# Altium project motordriver-v5.1.PrjPcb (part 2 of 3)

## Sheet motordriver-v5.0_driver-power-stage.SchDoc
size A4; SheetNumber: 6; SheetTotal: 12
Used 6 times, as channels Driver Power Stage 0, Driver Power Stage 1, Driver Power Stage 2, Driver Power Stage 3, Driver Power Stage 4, Driver Power Stage. Parts and nets are listed once, with the designators drawn on the sheet.
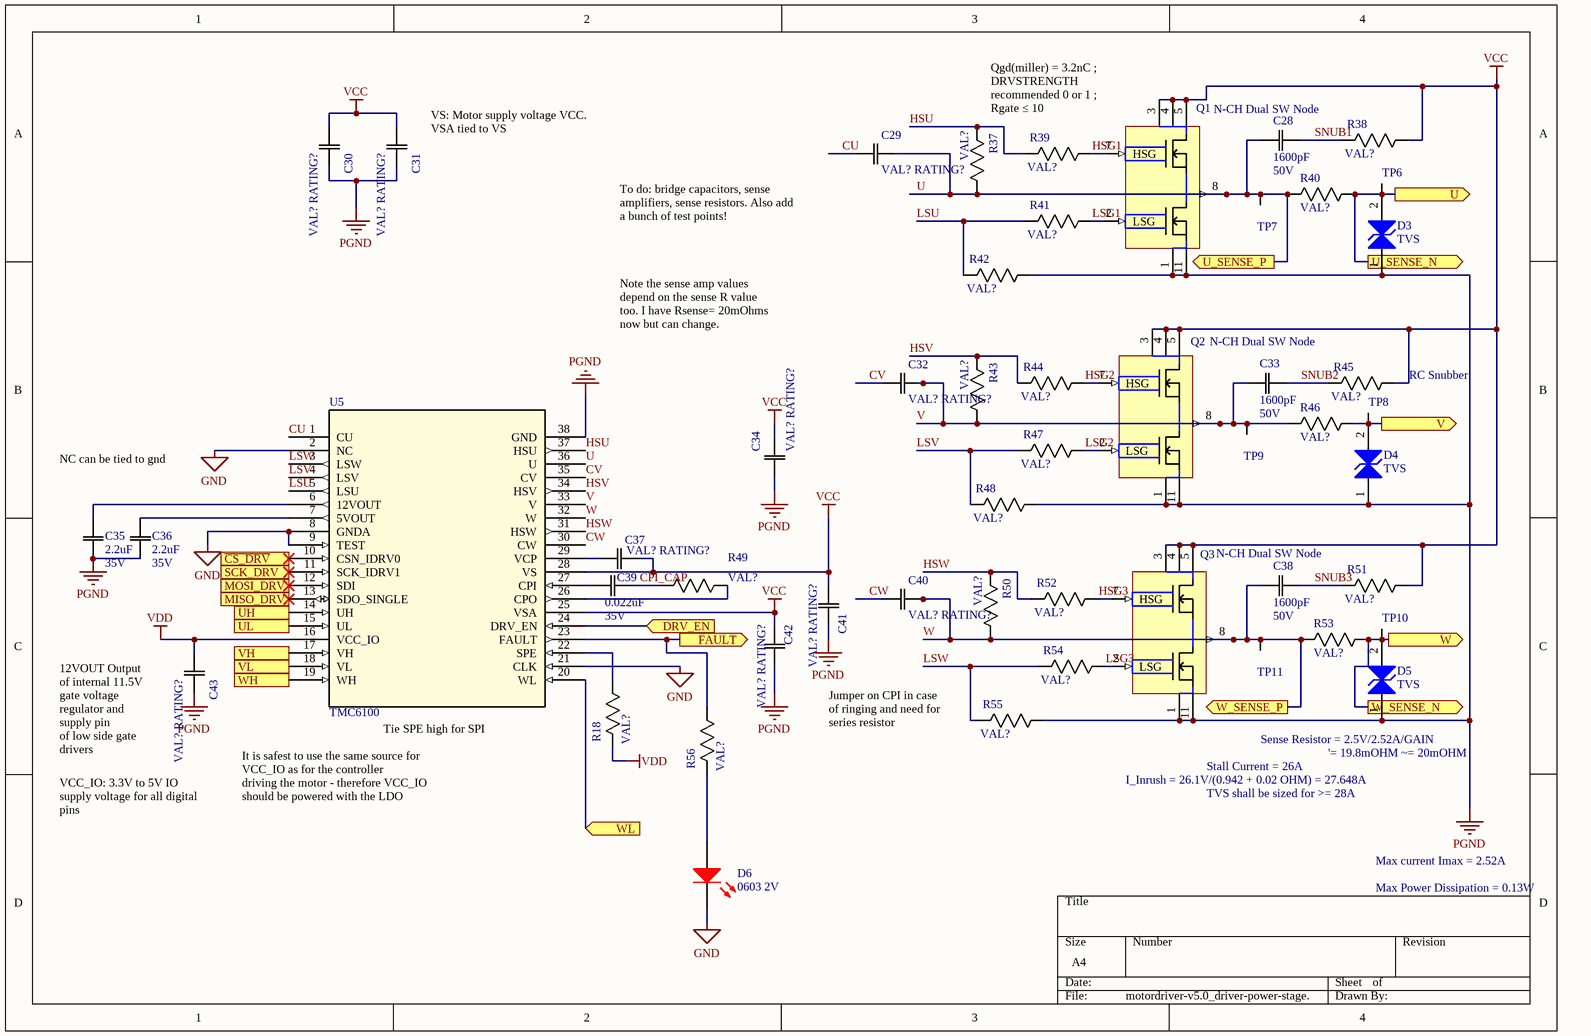
[diagram p6: motordriver-v5.0_driver-power-stage.SchDoc]

### Parts
C28  value 1600pF  Rating: 50V  [0603]  (hidden comment: VAL? RATING?)
C29  VAL? RATING?  [0603]
C30  VAL? RATING?  [0603]
C31  VAL? RATING?  [0805]
C32  VAL? RATING?  [0603]
C33  value 1600pF  Rating: 50V  [0603]  (hidden comment: VAL? RATING?)
C34  VAL? RATING?  [0805]
C35  value 2.2uF  Rating: 35V  [0603]  (hidden comment: VAL? RATING?)
C36  value 2.2uF  Rating: 35V  [0603]  (hidden comment: VAL? RATING?)
C37  VAL? RATING?  [0603]
C38  value 1600pF  Rating: 50V  [0603]  (hidden comment: VAL? RATING?)
C39  value 0.022uF  Rating: 35V  [0603]  (hidden comment: VAL? RATING?)
C40  VAL? RATING?  [0603]
C41  VAL? RATING?  [0603]
C42  VAL? RATING?  [0603]
C43  VAL? RATING?  [0603]
D3  TVS  [DO-214AC, SMA]
D4  TVS  [DO-214AC, SMA]
D5  TVS  [DO-214AC, SMA]
D6  0603 2V  [0603 - LED2]
Q1  N-CH Dual SW Node  [12-PowerWQFN]
Q2  N-CH Dual SW Node  [12-PowerWQFN]
Q3  N-CH Dual SW Node  [12-PowerWQFN]
R18  VAL?  [0603]
R37  VAL?  [0603]
R38  VAL?  [0603]
R39  VAL?  [0603]
R40  VAL?  [0603]
R41  VAL?  [0603]
R42  VAL?  [0603]
R43  VAL?  [0603]
R44  VAL?  [0603]
R45  VAL?  [0603]
R46  VAL?  [0603]
R47  VAL?  [0603]
R48  VAL?  [0603]
R49  VAL?  [0603]
R50  VAL?  [0603]
R51  VAL?  [0603]
R52  VAL?  [0603]
R53  VAL?  [0603]
R54  VAL?  [0603]
R55  VAL?  [0603]
R56  VAL?  [0603]
TP6  Test Point (Via)  [TP]  (value not drawn)
TP7  Test Point (Via)  [TP]  (value not drawn)
TP8  Test Point (Via)  [TP]  (value not drawn)
TP9  Test Point (Via)  [TP]  (value not drawn)
TP10  Test Point (Via)  [TP]  (value not drawn)
TP11  Test Point (Via)  [TP]  (value not drawn)
U5  TMC6100  [QFN50P700X700X85_HS-38N]

### Ports
DRV_EN (in), FAULT (out), MISO_DRV (out), MOSI_DRV (in), SCK_DRV (in), U (out), U_SENSE_N (out), U_SENSE_P (out), UH (in), UL (in), V (out), VH (in), VL (in), W (out), W_SENSE_N (out), W_SENSE_P (out), WH (in), WL (in), ~{CS_DRV} (in)

### Nets
GND: D6.2(K) U5.2(NC) U5.8(GNDA) U5.9(TEST) U5.21(CLK)
PGND: C30.2(C2) C31.2(C2) C34.1(C1) C35.1(C1) C36.1(C1) C41.2(C2) C42.2(C2) C43.2(C2) D3.1(K) D4.1(K) D5.1(K) Q1.1(GND) Q1.11(GND) Q2.1(GND) Q2.11(GND) Q3.1(GND) Q3.11(GND) R42.1(R1) R48.1(R1) R55.1(R1) U5.38(GND)
VCC: C30.1(C1) C31.1(C1) C34.2(C2) C37.2(C2) C41.1(C1) C42.1(C1) Q1.3(V+) Q1.4(V+) Q1.5(V+) Q2.3(V+) Q2.4(V+) Q2.5(V+) Q3.3(V+) Q3.4(V+) Q3.5(V+) R38.1(R1) R45.1(R1) R51.1(R1) U5.25(VSA) U5.28(VS)
VDD: C43.1(C1) R18.2(R2) U5.16(VCC_IO)
~{CS_DRV}: U5.10(CSN_IDRV0) ; port ~{CS_DRV}
CPI_CAP: C39.2(C2) R49.2(R2)
CU: C29.1(C1) U5.1(CU)
CV: C32.1(C1) U5.35(CV)
CW: C40.1(C1) U5.30(CW)
DRV_EN: U5.24(DRV_EN) ; port DRV_EN
FAULT: R56.1(R1) U5.23(FAULT) ; port FAULT
HSG1: Q1.7(HSG) R39.1(R1)
HSG2: Q2.7(HSG) R44.1(R1)
HSG3: Q3.7(HSG) R52.1(R1)
HSU: R37.2(R2) R39.2(R2) U5.37(HSU)
HSV: R43.2(R2) R44.2(R2) U5.34(HSV)
HSW: R50.2(R2) R52.2(R2) U5.31(HSW)
LSG1: Q1.2(LSG) R41.1(R1)
LSG2: Q2.2(LSG) R47.1(R1)
LSG3: Q3.2(LSG) R54.1(R1)
LSU: R41.2(R2) R42.2(R2) U5.5(LSU)
LSV: R47.2(R2) R48.2(R2) U5.4(LSV)
LSW: R54.2(R2) R55.2(R2) U5.3(LSW)
MISO_DRV: U5.13(SDO_SINGLE) ; port MISO_DRV
MOSI_DRV: U5.12(SDI) ; port MOSI_DRV
SCK_DRV: U5.11(SCK_IDRV1) ; port SCK_DRV
SNUB1: C28.1(C1) R38.2(R2)
SNUB2: C33.1(C1) R45.2(R2)
SNUB3: C38.1(C1) R51.2(R2)
U: C28.2(C2) C29.2(C2) Q1.8(SW) R37.1(R1) R40.2(R2) TP7.1 U5.36(U) ; port U_SENSE_P
U: D3.2(A) R40.1(R1) TP6.1 ; port U, port U_SENSE_N  [a separate net that carries the same name]
UH: U5.14(UH) ; port UH
UL: U5.15(UL) ; port UL
V: C32.2(C2) C33.2(C2) Q2.8(SW) R43.1(R1) R46.2(R2) TP9.1 U5.33(V)
V: D4.2(A) R46.1(R1) TP8.1 ; port V  [a separate net that carries the same name]
VH: U5.17(VH) ; port VH
VL: U5.18(VL) ; port VL
W: C38.2(C2) C40.2(C2) Q3.8(SW) R50.1(R1) R53.2(R2) TP11.1 U5.32(W) ; port W_SENSE_P
W: D5.2(A) R53.1(R1) TP10.1 ; port W, port W_SENSE_N  [a separate net that carries the same name]
WH: U5.19(WH) ; port WH
WL: U5.20(WL) ; port WL
NetC35_2: C35.2(C2) U5.6(12VOUT)
NetC36_2: C36.2(C2) U5.7(5VOUT)
NetC37_1: C37.1(C1) U5.29(VCP)
NetC39_1: C39.1(C1) U5.27(CPI)
NetD6_1: D6.1(A) R56.2(R2)
NetR18_1: R18.1(R1) U5.22(SPE)
NetR49_1: R49.1(R1) U5.26(CPO)

### Channels
Driver Power Stage 0: designators C28=C28A C29=C29A C30=C30A C31=C31A C32=C32A C33=C33A C34=C34A C35=C35A C36=C36A C37=C37A C38=C38A C39=C39A C40=C40A C41=C41A C42=C42A C43=C43A D3=D3A#2 D4=D4A#2 D5=D5A D6=D6A Q1=Q1A Q2=Q2A Q3=Q3A R18=R18A R37=R37A R38=R38A R39=R39A R40=R40A R41=R41A R42=R42A R43=R43A R44=R44A R45=R45A R46=R46A R47=R47A R48=R48A R49=R49A R50=R50A R51=R51A R52=R52A R53=R53A R54=R54A R55=R55A R56=R56A TP6=TP6A TP7=TP7A TP8=TP8A TP9=TP9A TP10=TP10A TP11=TP11A U5=U5A; ports DRV_EN=DRV_EN_0 FAULT=FAULT0 MISO_DRV=SPI_MISO_DRV0 MOSI_DRV=SPI_MOSI_DRV0 SCK_DRV=SPI_SCK_DRV0 U=U0 U_SENSE_N=U0 U_SENSE_P=U UH=UH0 UL=UL0 V=V0 VH=VH0 VL=VL0 W=W0 W_SENSE_N=W0 W_SENSE_P=W WH=WH0 WL=WL0 ~{CS_DRV}=~{CS_DRV}0
Driver Power Stage 1: designators C28=C28B C29=C29B C30=C30B C31=C31B C32=C32B C33=C33B C34=C34B C35=C35B C36=C36B C37=C37B C38=C38B C39=C39B C40=C40B C41=C41B C42=C42B C43=C43B D3=D3B#1 D4=D4B#1 D5=D5B D6=D6B Q1=Q1B Q2=Q2B Q3=Q3B R18=R18B R37=R37B R38=R38B R39=R39B R40=R40B R41=R41B R42=R42B R43=R43B R44=R44B R45=R45B R46=R46B R47=R47B R48=R48B R49=R49B R50=R50B R51=R51B R52=R52B R53=R53B R54=R54B R55=R55B R56=R56B TP6=TP6B TP7=TP7B TP8=TP8B TP9=TP9B TP10=TP10B TP11=TP11B U5=U5B; ports DRV_EN=DRV_EN_1 FAULT=FAULT1 MISO_DRV=SPI_MISO_DRV0 MOSI_DRV=SPI_MOSI_DRV0 SCK_DRV=SPI_SCK_DRV0 U=U1 U_SENSE_N=U1 U_SENSE_P=U UH=UH1 UL=UL1 V=V1 VH=VH1 VL=VL1 W=W1 W_SENSE_N=W1 W_SENSE_P=W WH=WH1 WL=WL1 ~{CS_DRV}=~{CS_DRV}1
Driver Power Stage 2: designators end in C; ports DRV_EN=DRV_EN_2 FAULT=FAULT2 MISO_DRV=SPI_MISO_DRV0 MOSI_DRV=SPI_MOSI_DRV0 SCK_DRV=SPI_SCK_DRV0 U=U2 U_SENSE_N=U2 U_SENSE_P=U UH=UH2 UL=UL2 V=V2 VH=VH2 VL=VL2 W=W2 W_SENSE_N=W2 W_SENSE_P=W WH=WH2 WL=WL2 ~{CS_DRV}=~{CS_DRV}2
Driver Power Stage 3: designators end in D; ports DRV_EN=DRV_EN_3 FAULT=FAULT3 MISO_DRV=SPI_MISO_DRV0 MOSI_DRV=SPI_MOSI_DRV0 SCK_DRV=SPI_SCK_DRV0 U=U3 U_SENSE_N=U3 U_SENSE_P=U UH=UH3 UL=UL3 V=V3 VH=VH3 VL=VL3 W=W3 W_SENSE_N=W3 W_SENSE_P=W WH=WH3 WL=WL3 ~{CS_DRV}=~{CS_DRV}3
Driver Power Stage 4: designators end in E; ports DRV_EN=DRV_EN_4 FAULT=FAULT4 MISO_DRV=SPI_MISO_DRV0 MOSI_DRV=SPI_MOSI_DRV0 SCK_DRV=SPI_SCK_DRV0 U=U4_IN U_SENSE_N=U4_IN U_SENSE_P=U UH=UH4 UL=UL4 V=V4_IN VH=VH4 VL=VL4 W=W4_IN W_SENSE_N=W4_IN W_SENSE_P=W WH=WH4 WL=WL4 ~{CS_DRV}=~{CS_DRV}4
Driver Power Stage: designators end in F; ports DRV_EN=DRV_EN FAULT=FAULT MISO_DRV=MISO_DRV_Driver Power Stage MOSI_DRV=MOSI_DRV_Driver Power Stage SCK_DRV=SCK_DRV_Driver Power Stage U=U_Driver Power Stage U_SENSE_N=U_Driver Power Stage U_SENSE_P=U_Driver Power Stage UH=UH_Driver Power Stage UL=UL_Driver Power Stage V=V_Driver Power Stage VH=VH_Driver Power Stage VL=VL_Driver Power Stage W=W_Driver Power Stage W_SENSE_N=W_Driver Power Stage W_SENSE_P=W_Driver Power Stage WH=WH_Driver Power Stage WL=WL_Driver Power Stage ~{CS_DRV}=~{CS_DRV}_Driver Power Stage

### Notes on the sheet
- Text
- (near Q1) Qgd(miller) = 3.2nC ; DRVSTRENGTH recommended 0 or 1 ; Rgate ≤ 10
- (near C31) VS: Motor supply voltage VCC. VSA tied to VS
- To do: bridge capacitors, sense amplifiers, sense resistors. Also add a bunch of test points!
- Note the sense amp values depend on the sense R value too. I have Rsense= 20mOhms now but can change.
- (near R45) RC Snubber
- NC can be tied to gnd
- (near C43) 12VOUT Output of internal 11.5V gate voltage regulator and supply pin
  of low side gate drivers
- Tie SPE high for SPI
- Jumper on CPI in case of ringing and need for series resistor
- I_Inrush = 26.1V/(0.942 + 0.02 OHM) = 27.648A
- Stall Current = 26A
- (near D5) Sense Resistor = 2.5V/2.52A/GAIN
- '= 19.8mOHM ~= 20mOHM
- VCC_IO: 3.3V to 5V IO supply voltage for all digital pins
- It is safest to use the same source for VCC_IO as for the controller
  driving the motor - therefore VCC_IO should be powered with the LDO
- TVS shall be sized for >= 28A
- Max current Imax = 2.52A
- Max Power Dissipation = 0.13W

### Library data of the parts
C28 C33 C38 = CAP 1600pF 50V: Default Symbol for Capacitors; Manufacturer Part Number 1: GRM1885C1H162JA01D; Tolerance: 5%; Temperature Coefficient: NP0; Part Number: CAP 1600pF 50V; Supplier 1: Digi-Key; Supplier Part Number 1: 490-1456-1-ND; Manufacturer Part Number 2: GRM2165C1H162JA01D; Supplier 2: Digi-Key; Supplier Part Number 2: 490-1625-1-ND
C29 C31 C32 C40 = CAP 470nF 50V: as C62 on sheet motordriver-v5.0_trinamic-controller-dribbler; Part Number: CAP 470nF 50V; Supplier 1: Digi-Key; Supplier Part Number 1: 445-5952-1-ND; Manufacturer Part Number 2: CL21B474KBFNNNG; Supplier 2: Digi-Key; Supplier Part Number 2: 1276-6482-1-ND
C30 C37 C41-C43 = CAP 100nF 50V: as C3 on sheet motordriver-v5.0_peripherals; Part Number: CAP 100nF 50V; Supplier 1: Digi-Key; Supplier Part Number 1: 311-3567-1-ND; Manufacturer Part Number 2: 0805J0500104KJT; Supplier 2: Digi-Key; Supplier Part Number 2: 1608-1458-1-ND
C34 = CAP 10uF 50V: Default Symbol for Capacitors; Manufacturer Part Number 1: GRM21BR61H106KE43L; Value: 10uF; Tolerance: 10%; Rating: 50V; Temperature Coefficient: X5R; Part Number: CAP 10uF 50V; Supplier 1: Digi-Key; Supplier Part Number 1: 490-18663-1-ND; Manufacturer Part Number 2: CL32B106KBJNNWE; Supplier 2: Digi-Key; Supplier Part Number 2: 1276-3388-1-ND
C35 C36 = CAP 2.2uF 35V: Default Symbol for Capacitors; Manufacturer Part Number 1: C1608X5R1V225K080AC; Tolerance: 10%; Temperature Coefficient: X5R; Part Number: CAP 2.2uF 35V; Supplier 1: Digi-Key; Supplier Part Number 1: 445-8025-1-ND; Manufacturer Part Number 2: CGA4J1X7R1V225K125AE; Supplier 2: Digi-Key; Supplier Part Number 2: 445-8787-1-ND
C39 = CAP 0.022uF 35V: Default Symbol for Capacitors; Manufacturer Part Number 1: GMK107BJ223KAHT; Tolerance: 10%; Temperature Coefficient: X7R; Part Number: CAP 0.022uF 35V; Supplier 1: Digi-Key; Supplier Part Number 1: 587-3359-1-ND; Manufacturer Part Number 2: GMK212SD223KG-T; Supplier 2: Digi-Key; Supplier Part Number 2: 587-1122-1-ND
D3-D5 = DIODE TVS 26VWM 53.5VC SMA: TVS DIODE 26V 53.5V SMA; Manufacturer Part Number: SMAJ26CA-TR; Power: 400W; Voltage Rating - DC: 26VWM, 53.5VC; Current Rating: 43A; Supplier 1: Digi-Key; Supplier Part Number 1: 497-12523-1-ND; Part Number: DIODE TVS 26VWM 53.5VC SMA; Supplier URL 1: https://www.digikey.ca/en/products/detail/stmicroelectronics/SMAJ26CA-TR/2214530?s=N4IgTCBcDaICwE4DsBaAjGArGAzOlAcgCIgC6AvkA; Pin Count: 2
D6 = LED RED SMD 0603: 0603 red led alingap 631nm-639nm water clear 18-180mcd 130d; Manufacturer Part Number: LTST-C190KRKT; Current Rating: 20mA; Supplier 1: Digi-Key; Supplier Part Number 1: 160-1436-1-ND; Part Number: LED RED SMD 0603; Supplier URL 1: https://www.digikey.ca/en/products/detail/lite-on-inc/LTST-C190KRKT/386817?s=N4IgTCBcDaIIwDYAMBaOAWAzAtKByAIiALoC%2BQA; Pin Count: 2; Voltage Rating - DC: 2V
Q1-Q3 = MOSFET N-CH DUAL NTTFD4D0N04HLTWG: MOSFET N+N COMMON PHASE SW 40V 60A; Manufacturer: ON Semiconductor; Supplier 1: Digi-Key; Manufacturer Part Number: NTTFD4D0N04HLTWG; RoHS: Yes; Category: MOSFETs; Stock 1: 3000; Pricing 1: 1=1.51000, 10=1.34800, 100=1.05120, 500=0.86840, 1000=0.72712 (USD); Supplier Part Number 1: 488-NTTFD4D0N04HLTWGCT-ND
R18 = RES 4.7k 1/8W - 5%: as R62 on sheet motordriver-v5.0_trinamic-controller-dribbler; Package: 0805; Part Number: RES 4.7k 1/8W - 5%
R37 R42 R43 R48 R50 R55 = RES 100k 1/8W: Default Resistor Symbol; Manufacturer Part Number 1: ERJ-H3GJ104V; Value: 100k; Power (Watts): 0.125W; Tolerance: 5%; Tolerance 2: 1%; Package: 0805; Part Number: RES 100k 1/8W; Supplier 1: Digi-Key; Supplier Part Number 1: 10-ERJ-H3GJ104VCT-ND; Manufacturer Part Number 2: RMCF0805FT100K; Supplier 2: Digi-Key; Supplier Part Number 2: RMCF0805FT100KCT-ND
R38 R39 R41 R44 R45 R47 R51 R52 R54 = RES 10.0 1/8W - 1%: Default Resistor Symbol; Manufacturer Part Number 1: RNCP0603FTD10R0; Value: 10; Power (Watts): 0.125W; Tolerance: 1%; Package: 0805; Part Number: RES 10.0 1/8W - 1%; Supplier 1: Digi-Key; Supplier Part Number 1: RNCP0603FTD10R0CT-ND; Manufacturer Part Number 2: RNCP0603FTD10R0; Supplier 2: Digi-Key; Supplier Part Number 2: RNCP0603FTD10R0CT-ND; Tolerance 2: 1%
R40 R46 R53 = RES 10m 1W: Default Resistor Symbol; Manufacturer Part Number 1: CSRL1-0R01F8; Value: 10m; Power (Watts): 0.125W; Tolerance: 1%; Package: 0805; Part Number: RES 10m 1W; Supplier 1: Digi-Key; Supplier Part Number 1: 696-1845-1-ND
R49 = RES 0 JUMPER: Default Resistor Symbol; Value: 1; Power (Watts): 0.125W; Tolerance: 5%; Package: 0805; Part Number: RES 0 JUMPER
R56 = RES 75.0 1/8W - 5%: as R61 on sheet motordriver-v5.0_trinamic-controller-dribbler; Package: 0805; Part Number: RES 75.0 1/8W - 5%; Supplier 1: Digi-Key; Supplier Part Number 1: RMCF0805JT75R0CT-ND; Manufacturer Part Number 2: RNCP0603FTD75R0; Supplier 2: Digi-Key; Supplier Part Number 2: RNCP0603FTD75R0CT-ND
U5 = TMC6100: GATE DRIVER IC 8-60V QFN37; Manufacturer Part Number: TMC6100-LA; Supplier 1: Newark; Supplier Part Number 1: 54AH1603; Part Number: TMC6100; Suppler URL 1: https://canada.newark.com/trinamic/tmc6100-la/motor-driver-40-to-125deg-c-rohs/dp/54AH1603?ost=54ah1603
TP6-TP11 = Test Point (Via): Part Number: Test Point (Via)

## Sheet motordriver-v5.0_trinamic-controller.SchDoc
size B; SheetNumber: 4; SheetTotal: 10
Used 5 times, as channels Trinamic Controller 0, Trinamic Controller 1, Trinamic Controller 2, Trinamic Controller 3, Trinamic Controller. Parts and nets are listed once, with the designators drawn on the sheet.
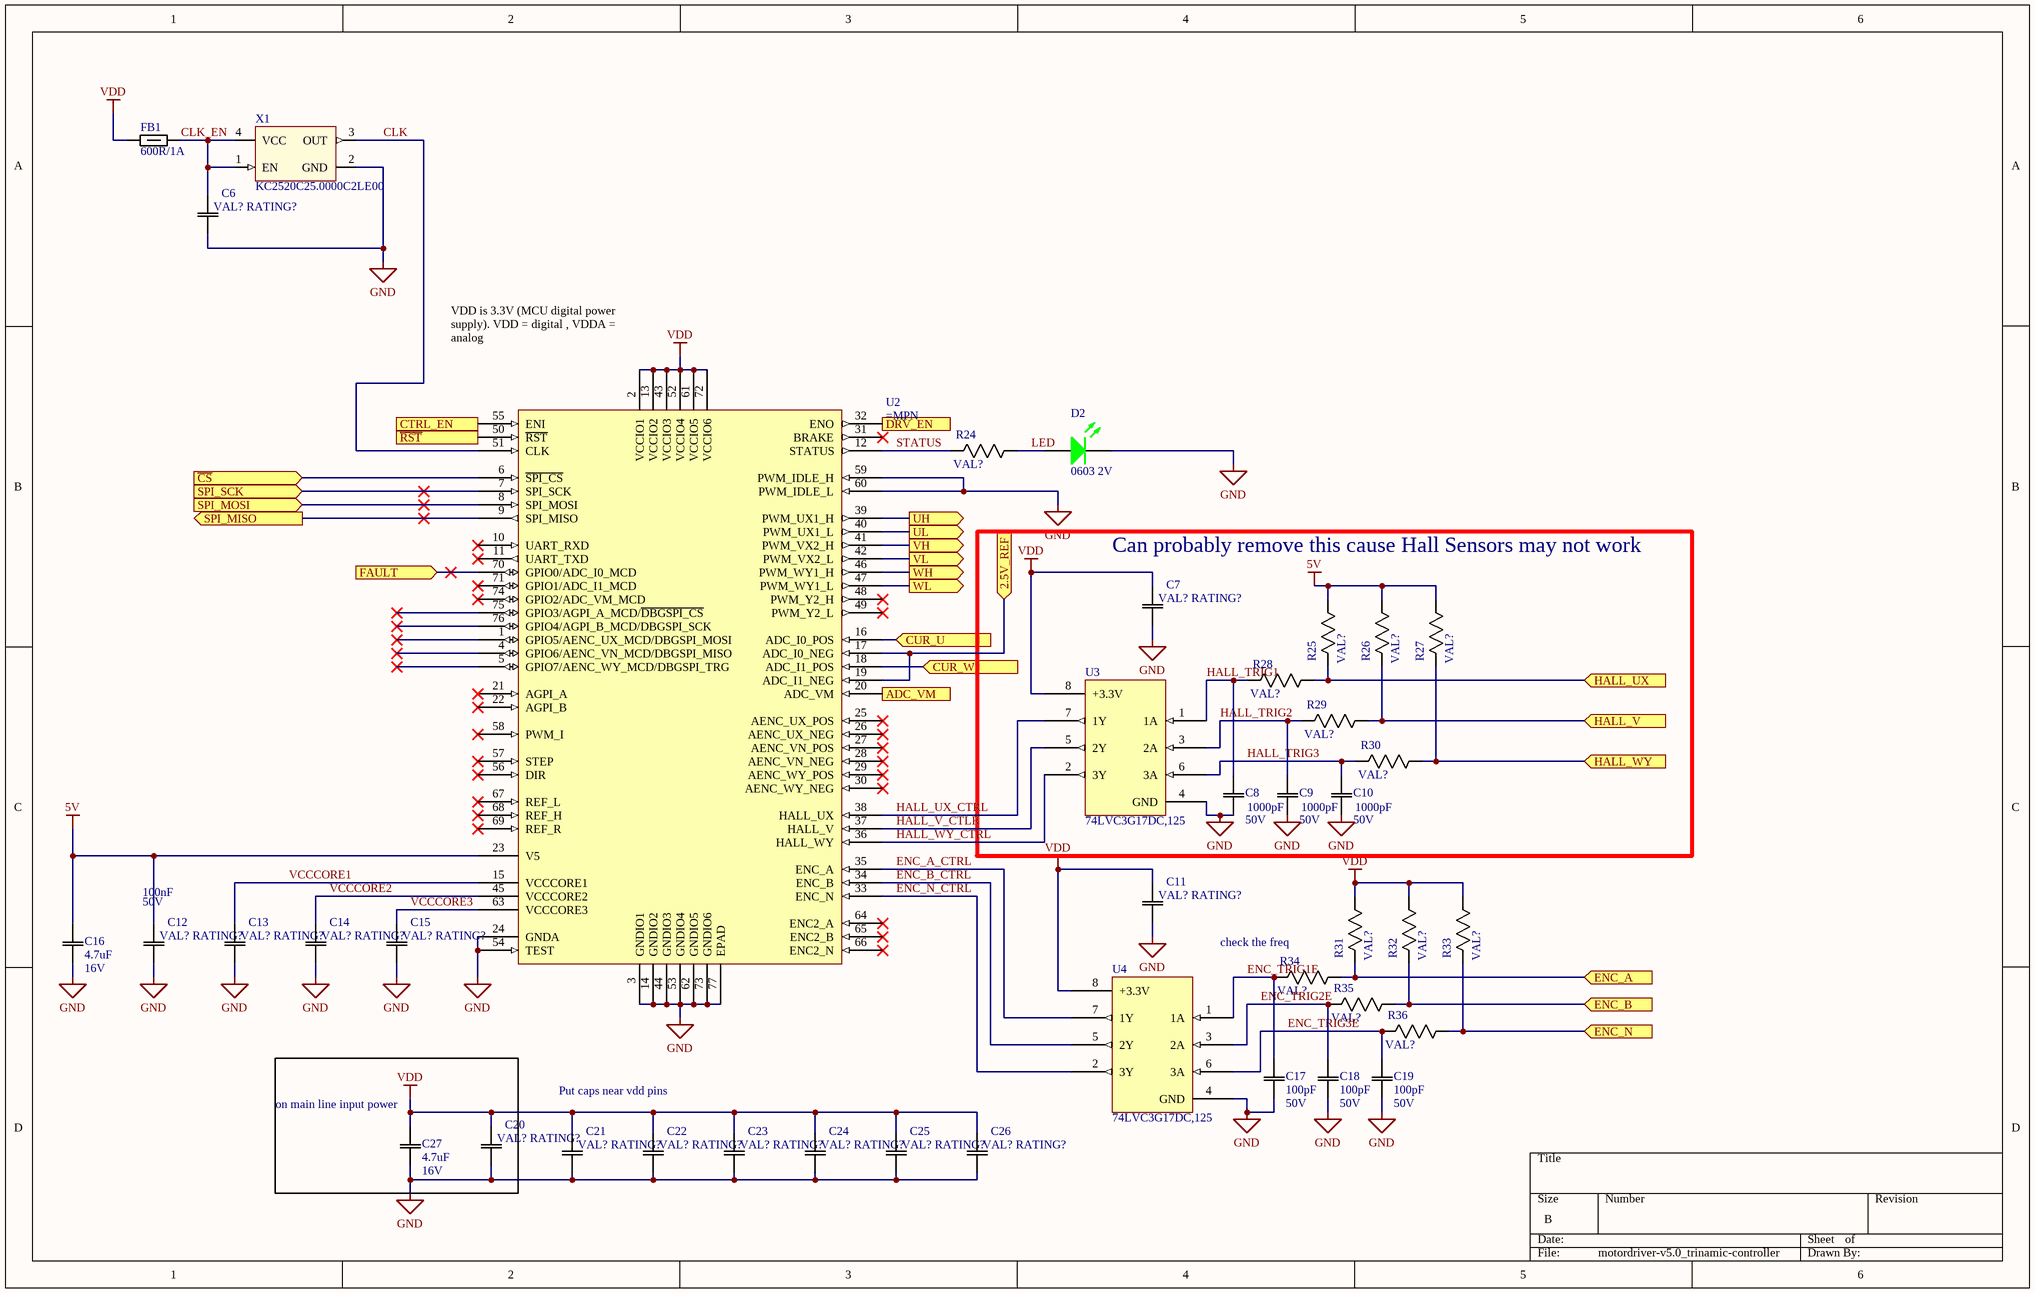
[diagram p7: motordriver-v5.0_trinamic-controller.SchDoc]

### Parts
C6  VAL? RATING?  [0603]
C7  VAL? RATING?  [0603]
C8  value 1000pF  Rating: 50V  [0603]  (hidden comment: VAL? RATING?)
C9  value 1000pF  Rating: 50V  [0603]  (hidden comment: VAL? RATING?)
C10  value 1000pF  Rating: 50V  [0603]  (hidden comment: VAL? RATING?)
C11  VAL? RATING?  [0603]
C12  VAL? RATING?  value 100nF  Rating: 50V  [0603]
C13  VAL? RATING?  [0603]
C14  VAL? RATING?  [0603]
C15  VAL? RATING?  [0603]
C16  value 4.7uF  Rating: 16V  [0603]  (hidden comment: VAL? RATING?)
C17  value 100pF  Rating: 50V  [0603]  (hidden comment: VAL? RATING?)
C18  value 100pF  Rating: 50V  [0603]  (hidden comment: VAL? RATING?)
C19  value 100pF  Rating: 50V  [0603]  (hidden comment: VAL? RATING?)
C20  VAL? RATING?  [0603]
C21  VAL? RATING?  [0603]
C22  VAL? RATING?  [0603]
C23  VAL? RATING?  [0603]
C24  VAL? RATING?  [0603]
C25  VAL? RATING?  [0603]
C26  VAL? RATING?  [0603]
C27  value 4.7uF  Rating: 16V  [0603]  (hidden comment: VAL? RATING?)
D2  0603 2V  [0603 - LED]
FB1  600R/1A  [0603]
R24  VAL?  [0603]
R25  VAL?  [0603]
R26  VAL?  [0603]
R27  VAL?  [0603]
R28  VAL?  [0603]
R29  VAL?  [0603]
R30  VAL?  [0603]
R31  VAL?  [0603]
R32  VAL?  [0603]
R33  VAL?  [0603]
R34  VAL?  [0603]
R35  VAL?  [0603]
R36  VAL?  [0603]
U2  (no value)  [QFN40P1050X650X90_HS-77N]
U3  74LVC3G17DC,125  [8-VSSOP]
U4  74LVC3G17DC,125  [8-VSSOP]
X1  KC2520C25.0000C2LE00  [KC2520C25.0000C2LE00]

### Blocks framed on the sheet
Can probably remove this cause Hall Sensors may not work: C7-C10 R25-R30 U3
on main line input power: C20 C27

### Ports
2.5V_REF (in), ADC_VM (in), CTRL_EN (in), CUR_U (in), CUR_W (in), DRV_EN (out), ENC_A (in), ENC_B (in), ENC_N (in), FAULT (in), HALL_UX (in), HALL_V (in), HALL_WY (in), SPI_MISO (out), SPI_MOSI (in), SPI_SCK (in), UH (out), UL (out), VH (out), VL (out), WH (out), WL (out), ~{CS} (in), ~{RST} (in)

### Nets
5V: C12.2(C2) C16.2(C2) R25.1(R1) R26.1(R1) R27.1(R1) U2.23(V5)
GND: C6.1(C1) C7.1(C1) C8.1(C1) C9.1(C1) C10.1(C1) C11.1(C1) C12.1(C1) C13.1(C1) C14.1(C1) C15.1(C1) C16.1(C1) C17.1(C1) C18.1(C1) C19.1(C1) C20.1(C1) C21.1(C1) C22.1(C1) C23.1(C1) C24.1(C1) C25.1(C1) C26.1(C1) C27.1(C1) D2.2(K) U2.3(GNDIO1) U2.14(GNDIO2) U2.24(GNDA) U2.44(GNDIO3) U2.53(GNDIO4) U2.54(TEST) U2.59(PWM_IDLE_H) U2.60(PWM_IDLE_L) U2.62(GNDIO5) U2.73(GNDIO6) U2.77(EPAD) U3.4(GND) U4.4(GND) X1.2(GND)
VDD: C7.2(C2) C11.2(C2) C20.2(C2) C21.2(C2) C22.2(C2) C23.2(C2) C24.2(C2) C25.2(C2) C26.2(C2) C27.2(C2) FB1.1 R31.1(R1) R32.1(R1) R33.1(R1) U2.2(VCCIO1) U2.13(VCCIO2) U2.43(VCCIO3) U2.52(VCCIO4) U2.61(VCCIO5) U2.72(VCCIO6) U3.8(+3.3V) U4.8(+3.3V)
2.5V_REF: U2.17(ADC_I0_NEG) U2.19(ADC_I1_NEG) ; port 2.5V_REF
ADC_VM: U2.20(ADC_VM) ; port ADC_VM
~{CS}: U2.6(~{SPI_CS}) ; port ~{CS}
CLK: U2.51(CLK) X1.3(OUT)
CLK_EN: C6.2(C2) FB1.2 X1.1(EN) X1.4(VCC)
CTRL_EN: U2.55(ENI) ; port CTRL_EN
CUR_U: U2.16(ADC_I0_POS) ; port CUR_U
CUR_W: U2.18(ADC_I1_POS) ; port CUR_W
DRV_EN: U2.32(ENO) ; port DRV_EN
ENC_A: R31.2(R2) R34.1(R1) ; port ENC_A
ENC_A_CTRL: U2.35(ENC_A) U4.7(1Y)
ENC_B: R32.2(R2) R35.1(R1) ; port ENC_B
ENC_B_CTRL: U2.34(ENC_B) U4.5(2Y)
ENC_N: R33.2(R2) R36.1(R1) ; port ENC_N
ENC_N_CTRL: U2.33(ENC_N) U4.2(3Y)
ENC_TRIG1E: C17.2(C2) R34.2(R2) U4.1(1A)
ENC_TRIG2E: C18.2(C2) R35.2(R2) U4.3(2A)
ENC_TRIG3E: C19.2(C2) R36.2(R2) U4.6(3A)
FAULT: U2.70(GPIO0/ADC_I0_MCD) ; port FAULT
HALL_TRIG1: C8.2(C2) R28.2(R2) U3.1(1A)
HALL_TRIG2: C9.2(C2) R29.2(R2) U3.3(2A)
HALL_TRIG3: C10.2(C2) R30.2(R2) U3.6(3A)
HALL_UX: R25.2(R2) R28.1(R1) ; port HALL_UX
HALL_UX_CTRL: U2.38(HALL_UX) U3.7(1Y)
HALL_V: R26.2(R2) R29.1(R1) ; port HALL_V
HALL_V_CTLR: U2.37(HALL_V) U3.5(2Y)
HALL_WY: R27.2(R2) R30.1(R1) ; port HALL_WY
HALL_WY_CTRL: U2.36(HALL_WY) U3.2(3Y)
LED: D2.1(A) R24.1(R1)
~{RST}: U2.50(~{RST}) ; port ~{RST}
SPI_MISO: U2.9(SPI_MISO) ; port SPI_MISO
SPI_MOSI: U2.8(SPI_MOSI) ; port SPI_MOSI
SPI_SCK: U2.7(SPI_SCK) ; port SPI_SCK
STATUS: R24.2(R2) U2.12(STATUS)
UH: U2.39(PWM_UX1_H) ; port UH
UL: U2.40(PWM_UX1_L) ; port UL
VCCCORE1: C13.2(C2) U2.15(VCCCORE1)
VCCCORE2: C14.2(C2) U2.45(VCCCORE2)
VCCCORE3: C15.2(C2) U2.63(VCCCORE3)
VH: U2.41(PWM_VX2_H) ; port VH
VL: U2.42(PWM_VX2_L) ; port VL
WH: U2.46(PWM_WY1_H) ; port WH
WL: U2.47(PWM_WY1_L) ; port WL

Not connected (* = marked no-connect by the designer): U2 1(GPIO5/AENC_UX_MCD/DBGSPI_MOSI)* 4(GPIO6/AENC_VN_MCD/DBGSPI_MISO)* 5(GPIO7/AENC_WY_MCD/DBGSPI_TRG)* 10(UART_RXD)* 11(UART_TXD)* 21(AGPI_A)* 22(AGPI_B)* 25(AENC_UX_POS)* 26(AENC_UX_NEG)* 27(AENC_VN_POS)* 28(AENC_VN_NEG)* 29(AENC_WY_POS)* 30(AENC_WY_NEG)* 31(BRAKE)* 48(PWM_Y2_H)* 49(PWM_Y2_L)* 56(DIR)* 57(STEP)* 58(PWM_I)* 64(ENC2_A)* 65(ENC2_B)* 66(ENC2_N)* 67(REF_L)* 68(REF_H)* 69(REF_R)* 71(GPIO1/ADC_I1_MCD)* 74(GPIO2/ADC_VM_MCD)* 75(GPIO3/AGPI_A_MCD/~{DBGSPI_CS})* 76(GPIO4/AGPI_B_MCD/DBGSPI_SCK)*

### Channels
Trinamic Controller 0: designators C6=C6A C7=C17_E C8=C18_E C9=C19_E C10=C20_E C11=C21_E C12=C23_E C13=C13A C14=C14A C15=C15A C16=C22_E C17=C17A C18=C18A C19=C19A C20=C31_E C21=C32_E C22=C33_E C23=C34_E C24=C35_E C25=C36_E C26=C37_E C27=C30_E D2=D2A#2 FB1=FB1A R24=R24A R25=R26_E R26=R27_E R27=R28_E R28=R29_E R29=R30_E R30=R31_E R31=R32_E R32=R33_E R33=R34_E R34=R35_E R35=R36_E R36=R37_E U2=U2A U3=U3A U4=U4A X1=X1A; ports 2.5V_REF=2.5V_REF ADC_VM=ADC_VM CTRL_EN=CTRL_EN CUR_U=CUR_U0 CUR_W=CUR_W0 DRV_EN=DRV_EN_0 ENC_A=ENC_A0 ENC_B=ENC_B0 ENC_N=ENC_N0 FAULT=FAULT0 HALL_UX=HALL_UX0 HALL_V=HALL_V0 HALL_WY=HALL_WY0 SPI_MISO=SPI_MISO0 SPI_MOSI=SPI_MOSI0 SPI_SCK=SPI_SCK0 UH=UH0 UL=UL0 VH=VH0 VL=VL0 WH=WH0 WL=WL0 ~{CS}=~{CS}0 ~{RST}=2.5V_REF
Trinamic Controller 1: designators C6=C6B C7=C17_D C8=C18_D C9=C19_D C10=C20_D C11=C21_D C12=C23_D C13=C13B C14=C14B C15=C15B C16=C22_D C17=C17B C18=C18B C19=C19B C20=C31_D C21=C32_D C22=C33_D C23=C34_D C24=C35_D C25=C36_D C26=C37_D C27=C30_D D2=D2B#1 FB1=FB1B R24=R24B R25=R26_D R26=R27_D R27=R28_D R28=R29_D R29=R30_D R30=R31_D R31=R32_D R32=R33_D R33=R34_D R34=R35_D R35=R36_D R36=R37_D U2=U2B U3=U3B U4=U4B X1=X1B; ports 2.5V_REF=2.5V_REF ADC_VM=ADC_VM CTRL_EN=CTRL_EN CUR_U=CUR_U1 CUR_W=CUR_W1 DRV_EN=DRV_EN_1 ENC_A=ENC_A1 ENC_B=ENC_B1 ENC_N=ENC_N1 FAULT=FAULT1 HALL_UX=HALL_UX1 HALL_V=HALL_V1 HALL_WY=HALL_WY1 SPI_MISO=SPI_MISO0 SPI_MOSI=SPI_MOSI0 SPI_SCK=SPI_SCK0 UH=UH1 UL=UL1 VH=VH1 VL=VL1 WH=WH1 WL=WL1 ~{CS}=~{CS}1 ~{RST}=2.5V_REF
Trinamic Controller 2: designators C6=C6C C7=C17_C C8=C18_C C9=C19_C C10=C20_C C11=C21_C C12=C23_C C13=C13C C14=C14C C15=C15C C16=C22_C C17=C17C C18=C18C C19=C19C C20=C31_C C21=C32_C C22=C33_C C23=C34_C C24=C35_C C25=C36_C C26=C37_C C27=C30_C D2=D2C FB1=FB1C R24=R24C R25=R26_C R26=R27_C R27=R28_C R28=R29_C R29=R30_C R30=R31_C R31=R32_C R32=R33_C R33=R34_C R34=R35_C R35=R36_C R36=R37_C U2=U2C U3=U3C U4=U4C X1=X1C; ports 2.5V_REF=2.5V_REF ADC_VM=ADC_VM CTRL_EN=CTRL_EN CUR_U=CUR_U2 CUR_W=CUR_W2 DRV_EN=DRV_EN_2 ENC_A=ENC_A2 ENC_B=ENC_B2 ENC_N=ENC_N2 FAULT=FAULT2 HALL_UX=HALL_UX2 HALL_V=HALL_V2 HALL_WY=HALL_WY2 SPI_MISO=SPI_MISO0 SPI_MOSI=SPI_MOSI0 SPI_SCK=SPI_SCK0 UH=UH2 UL=UL2 VH=VH2 VL=VL2 WH=WH2 WL=WL2 ~{CS}=~{CS}2 ~{RST}=2.5V_REF
Trinamic Controller 3: designators C6=C6D C7=C17_B C8=C18_B C9=C19_B C10=C20_B C11=C21_B C12=C23_B C13=C13D C14=C14D C15=C15D C16=C22_B C17=C17D C18=C18D C19=C19D C20=C31_B C21=C32_B C22=C33_B C23=C34_B C24=C35_B C25=C36_B C26=C37_B C27=C30_B D2=D2D FB1=FB1D R24=R24D R25=R26_B R26=R27_B R27=R28_B R28=R29_B R29=R30_B R30=R31_B R31=R32_B R32=R33_B R33=R34_B R34=R35_B R35=R36_B R36=R37_B U2=U2D U3=U3D U4=U4D X1=X1D; ports 2.5V_REF=2.5V_REF ADC_VM=ADC_VM CTRL_EN=CTRL_EN CUR_U=CUR_U3 CUR_W=CUR_W3 DRV_EN=DRV_EN_3 ENC_A=ENC_A3 ENC_B=ENC_B3 ENC_N=ENC_N3 FAULT=FAULT3 HALL_UX=HALL_UX3 HALL_V=HALL_V3 HALL_WY=HALL_WY3 SPI_MISO=SPI_MISO0 SPI_MOSI=SPI_MOSI0 SPI_SCK=SPI_SCK0 UH=UH3 UL=UL3 VH=VH3 VL=VL3 WH=WH3 WL=WL3 ~{CS}=~{CS}3 ~{RST}=2.5V_REF
Trinamic Controller: designators C6=C6E C7=C17_A C8=C18_A C9=C19_A C10=C20_A C11=C21_A C12=C23_A C13=C13E C14=C14E C15=C15E C16=C22_A C17=C17E C18=C18E C19=C19E C20=C31_A C21=C32_A C22=C33_A C23=C34_A C24=C35_A C25=C36_A C26=C37_A C27=C30_A D2=D2E FB1=FB1E R24=R24E R25=R26_A R26=R27_A R27=R28_A R28=R29_A R29=R30_A R30=R31_A R31=R32_A R32=R33_A R33=R34_A R34=R35_A R35=R36_A R36=R37_A U2=U2E U3=U3E U4=U4E X1=X1E; ports 2.5V_REF=2.5V_REF ADC_VM=ADC_VM CTRL_EN=CTRL_EN_Trinamic Controller CUR_U=CUR_U_Trinamic Controller CUR_W=CUR_W_Trinamic Controller DRV_EN=DRV_EN ENC_A=ENC_A_Trinamic Controller ENC_B=ENC_B_Trinamic Controller ENC_N=ENC_N_Trinamic Controller FAULT=FAULT HALL_UX=HALL_UX_Trinamic Controller HALL_V=HALL_V_Trinamic Controller HALL_WY=HALL_WY_Trinamic Controller SPI_MISO=SPI_MISO_Trinamic Controller SPI_MOSI=SPI_MOSI_Trinamic Controller SPI_SCK=SPI_SCK_Trinamic Controller UH=UH_Trinamic Controller UL=UL_Trinamic Controller VH=VH_Trinamic Controller VL=VL_Trinamic Controller WH=WH_Trinamic Controller WL=WL_Trinamic Controller ~{CS}=~{CS}_Trinamic Controller ~{RST}=~{RST}

### Notes on the sheet
- (near U2) VDD is 3.3V (MCU digital power supply). VDD = digital , VDDA = analog
- (near R34) check the freq
- Put caps near vdd pins

### Library data of the parts
C6 C7 C11 C13-C15 C21-C26 = CAP 100nF 50V: Default Symbol for Capacitors; Manufacturer Part Number 1: CC0603KPX7R9BB104; Value: 100nF; Tolerance: 10%; Rating: 50V; Temperature Coefficient: X7R; Part Number: CAP 100nF 50V; Supplier 1: Digi-Key; Supplier Part Number 1: 311-3567-1-ND; Manufacturer Part Number 2: 0805J0500104KJT; Supplier 2: Digi-Key; Supplier Part Number 2: 1608-1458-1-ND
C8-C10 = CAP 1000pF 50V: Default Symbol for Capacitors; Manufacturer Part Number 1: 06035C102K4Z2A / 06035C102K4Z2A; Tolerance: 10%; Temperature Coefficient: X7R; Part Number: CAP 1000pF 50V; Supplier 1: Digi-Key; Supplier Part Number 1: 478-6342-1-ND; Manufacturer Part Number 2: 08055C102KAT2A; Supplier 2: Digi-Key; Supplier Part Number 2: 478-1371-1-ND
C12 = CAP 100nF 50V: Default Symbol for Capacitors; Manufacturer Part Number 1: CC0603KPX7R9BB104; Tolerance: 10%; Temperature Coefficient: X7R; Part Number: CAP 100nF 50V; Supplier 1: Digi-Key; Supplier Part Number 1: 311-3567-1-ND; Manufacturer Part Number 2: 0805J0500104KJT; Supplier 2: Digi-Key; Supplier Part Number 2: 1608-1458-1-ND
C16 C27 = CAP 4.7uF 16V: Default Symbol for Capacitors; Manufacturer Part Number 1: C1608X5R1C475K080AE; Tolerance: 10%; Temperature Coefficient: X5R; Part Number: CAP 4.7uF 16V; Supplier 1: Digi-Key; Supplier Part Number 1: 445-175225-1-ND; Manufacturer Part Number 2: C2012X5R1C475K085AB; Supplier 2: Digi-Key; Supplier Part Number 2: 445-14382-1-ND
C17-C19 = CAP 100pF 50V: Default Symbol for Capacitors; Manufacturer Part Number 1: C0603C101K5RAC7867; Tolerance: 10%; Temperature Coefficient: X7R; Part Number: CAP 100pF 50V; Supplier 1: Digi-Key; Supplier Part Number 1: 399-C0603C101K5RAC7867CT-ND; Manufacturer Part Number 2: C0805C101J5RAC7800; Supplier 2: Digi-Key; Supplier Part Number 2: 399-17420-1-ND
C20 = CAP 470nF 50V: Default Symbol for Capacitors; Manufacturer Part Number 1: C1608X7R1H474K080AC; Value: 470nF; Tolerance: 10%; Rating: 50V; Temperature Coefficient: X7R; Part Number: CAP 470nF 50V; Supplier 1: Digi-Key; Supplier Part Number 1: 445-5952-1-ND; Manufacturer Part Number 2: CL21B474KBFNNNG; Supplier 2: Digi-Key; Supplier Part Number 2: 1276-6482-1-ND
D2 = LED GREEN SMD 0603: LED Uni-Color Green 574nm 2-Pin Chip LED T/R; Manufacturer Part Number: LTST-C190KGKT; Current Rating: 20mA; Supplier 1: Digi-Key; Supplier Part Number 1: 160-1435-1-ND; Part Number: LED GREEN SMD 0603; Supplier URL 1: https://www.digikey.ca/en/products/detail/lite-on-inc/LTST-C190KGKT/386815?s=N4IgTCBcDaIIwDYAMBaOAWAzAVjSgcgCIgC6AvkA; Pin Count: 2; Voltage Rating - DC: 2V
FB1 = FERRITE BEAD 200 MOHM 0603 1LN: WURTH ELEKTRONIK - 742792651 - Ferrite Bead, 0603 [1608 Metric], 600 ohm, 1 A, WE-CBF Series, 0.2 ohm, &#177; 25%; Manufacturer Part Number: 742792651-220-R; Value: 600R/1A @ 100 MHz; Supplier 1: Digi-Key; Supplier Part Number 1: 732-1593-1-ND; Part Number: FERRITE BEAD 200 MOHM 0603 1LN; Supplier URL 1: https://www.digikey.ca/en/products/detail/w%C3%BCrth-elektronik/742792651/1638997?s=N4IgTCBcDaIOwGYwFoCMBWAnAtyByAIiALoC%2BQA
R24 = RES 75.0 1/8W - 5%: Default Resistor Symbol; Manufacturer Part Number 1: RMCF0805JT75R0; Value: 75; Power (Watts): 0.125W; Tolerance: 5%; Tolerance 2: 1%; Package: 0805; Part Number: RES 75.0 1/8W - 5%; Supplier 1: Digi-Key; Supplier Part Number 1: RMCF0805JT75R0CT-ND; Manufacturer Part Number 2: RNCP0603FTD75R0; Supplier 2: Digi-Key; Supplier Part Number 2: RNCP0603FTD75R0CT-ND
R25-R33 = RES 4.7k 1/8W - 5%: Default Resistor Symbol; Value: 1; Power (Watts): 0.125W; Tolerance: 5%; Package: 0805; Part Number: RES 4.7k 1/8W - 5%
R34-R36 = RES 1k 1/8W - 1%: Default Resistor Symbol; Manufacturer Part Number 1: MCT06030C1001FP500; Value: 1k; Power (Watts): 0.125W; Tolerance: 1%; Package: 0805; Part Number: RES 1k 1/8W - 1%; Supplier 1: Digi-Key; Supplier Part Number 1: MCT0603-1.00K-CFCT-ND; Manufacturer Part Number 2: RMCF0805FT1K00; Supplier 2: Digi-Key; Supplier Part Number 2: RMCF0805FT1K00CT-ND; Tolerance 2: 1%
U2 = TMC4671: Motor Driver, -40 To 125Deg C Rohs Compliant: Yes; Manufacturer Part Number: TMC4671-LA; Supplier 1: Digi-Key; Supplier Part Number 1: 1460-TMC4671-LA-ND; Part Number: TMC4671; Suppler URL 1: https://www.digikey.ca/en/products/detail/trinamic-motion-control-gmbh/TMC4671-LA/12174669?s=N4IgTCBcDaIIwBYBsAGAtAFQLIGFkHY40AZAQTQDkAREAXQF8g
U3 U4 = IC 74LVC3G17DC,125: IC BUFFER TRIPLE SCHMITT TRIGGER 5.5V VSSOP-8; Manufacturer: Nexperia; Supplier 1: Newark; Manufacturer Part Number: 74LVC3G17DC,125; RoHS: Yes; Category: Logic Gates; Stock 1: 2995; Pricing 1: 1=0.84800, 5=0.83500, 10=0.70800, 25=0.62000, 50=0.53200, 100=0.44500, 250=0.41300, 500=0.38300, 1000=0.35200 (USD); RoHS Compliant: Yes; Supplier Part Number 1: 33AC1281
X1 = XTAL OSC 25MHz 3.3V: Oscillator XO 25MHz ±15ppm 15pF CMOS 55% 2.5V/3.3V 4-Pin Mini-CSMD T/R; Frequency: 32.768kHz; Load Capacitance: 12.5pF; Supplier 1: Digi-Key; Manufacturer Part Number: KC2520C25.0000C2LE00; Supplier Part Number 1: 1253-1254-6-ND; Part Number: XTAL OSC 25MHz 3.3V; Supplier URL 1: https://www.digikey.ca/en/products/detail/kyocera-avx/KC2520C25-0000C2LE00/4867084?s=N4IgTCBcDaIIxgKwGYC0DEBZUDZUDkAREAXQF8g

## Sheet motordriver-v5.0_connectors.SchDoc
size A4; SheetNumber: 8; SheetTotal: 10
Used 5 times, as channels Connectors 0, Connectors 1, Connectors 2, Connectors 3, Connectors. Parts and nets are listed once, with the designators drawn on the sheet.
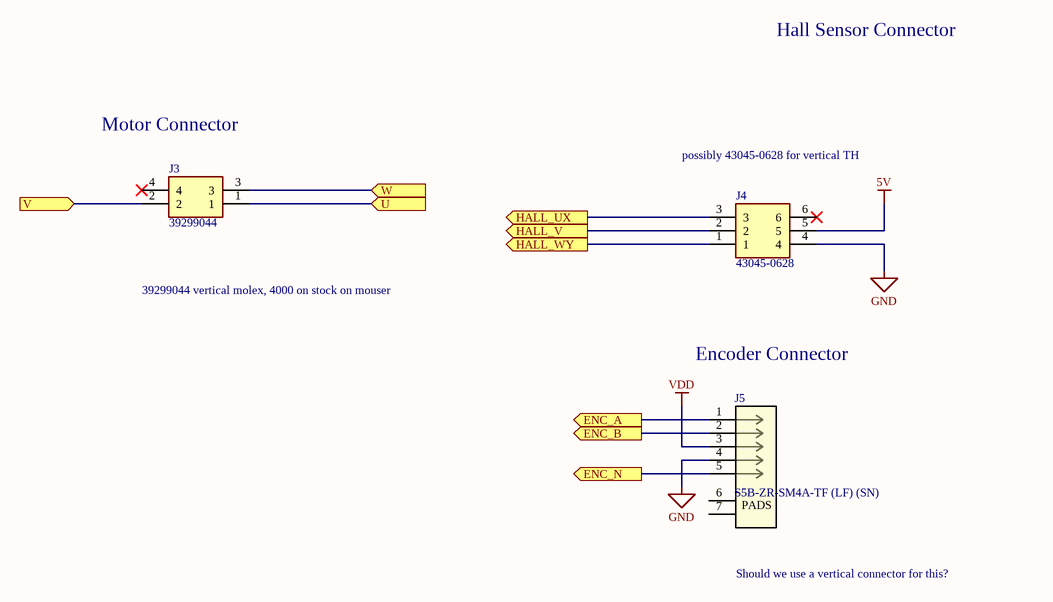
[diagram p8: motordriver-v5.0_connectors.SchDoc]

### Parts
J3  39299044  [39299044]
J4  43045-0628  [430450628]
J5  S5B-ZR-SM4A-TF (LF) (SN)  [JST_S5B-ZR-SM4A-TF]

### Ports
ENC_A (out), ENC_B (out), ENC_N (out), HALL_UX (out), HALL_V (out), HALL_WY (out), U (in), V (in), W (in)

### Nets
5V: J4.5
GND: J4.4 J5.4
VDD: J5.3
ENC_A: J5.1 ; port ENC_A
ENC_B: J5.2 ; port ENC_B
ENC_N: J5.5 ; port ENC_N
HALL_UX: J4.3 ; port HALL_UX
HALL_V: J4.2 ; port HALL_V
HALL_WY: J4.1 ; port HALL_WY
U: J3.1 ; port U
V: J3.2 ; port V
W: J3.3 ; port W

Not connected (* = marked no-connect by the designer): J3 4*; J4 6*; J5 6 7

### Channels
Connectors 0: designators end in A; ports ENC_A=ENC_A0 ENC_B=ENC_B0 ENC_N=ENC_N0 HALL_UX=HALL_UX0 HALL_V=HALL_V0 HALL_WY=HALL_WY0 U=U0 V=V0 W=W0
Connectors 1: designators end in B; ports ENC_A=ENC_A1 ENC_B=ENC_B1 ENC_N=ENC_N1 HALL_UX=HALL_UX1 HALL_V=HALL_V1 HALL_WY=HALL_WY1 U=U1 V=V1 W=W1
Connectors 2: designators end in C; ports ENC_A=ENC_A2 ENC_B=ENC_B2 ENC_N=ENC_N2 HALL_UX=HALL_UX2 HALL_V=HALL_V2 HALL_WY=HALL_WY2 U=U2 V=V2 W=W2
Connectors 3: designators end in D; ports ENC_A=ENC_A3 ENC_B=ENC_B3 ENC_N=ENC_N3 HALL_UX=HALL_UX3 HALL_V=HALL_V3 HALL_WY=HALL_WY3 U=U3 V=V3 W=W3
Connectors: designators end in E; ports ENC_A=ENC_A_Connectors ENC_B=ENC_B_Connectors ENC_N=ENC_N_Connectors HALL_UX=HALL_UX_Connectors HALL_V=HALL_V_Connectors HALL_WY=HALL_WY_Connectors U=U_Connectors V=V_Connectors W=W_Connectors

### Notes on the sheet
- Hall Sensor Connector
- Motor Connector
- possibly 43045-0628 for vertical TH
- 39299044 vertical molex, 4000 on stock on mouser
- Encoder Connector
- Should we use a vertical connector for this?
- (in symbol CN 5POS JST ZR RA) PADS

### Library data of the parts
J3 = CN HDR 4POS Molex 39299044 VERT: Molex 39299044 4POS Minifit / dual row, vertical; Supplier 1: Digi-Key; Supplier Part Number 1: WM7336-ND; Part Number: CN HDR 4POS Molex 39299044 VERT; Manufacturer Part Number: 39299044; Supplier URL 1: https://www.digikey.ca/en/products/detail/molex/0039299044/1624292?s=N4IgTCBcDaIOoFkDsBmFA2AtAOQCIgF0BfIA; Pin Count: 4
J4 = CN HDR 6POS Molex 43045-0628: Molex 43045-0628 6POS Microfit / dual row, Vertical; Supplier 1: Digi-Key; Supplier Part Number 1: WM10679-ND; Part Number: CN HDR 6POS Molex 43045-0628; Manufacturer Part Number: 430450628; Supplier URL 1: https://www.digikey.ca/en/products/detail/molex/0430450628/3310200?s=N4IgTCBcDaICwGYAMcCsSBsYAcAdXIAugL5A; Pin Count: 6
J5 = CN 5POS JST ZR RA: Connector Header Surface Mount, Right Angle 5 position 0.059" (1.50mm); Supplier 1: Digi-Key; Supplier Part Number 1: 455-1696-1-ND; Part Number: CN 5POS JST ZR RA; Manufacturer Part Number: S5B-ZR-SM4A-TF; Supplier URL 1: https://www.digikey.ca/en/products/detail/jst-sales-america-inc/S5B-ZR-SM4A-TF-LF-SN/926603?s=N4IgTCBcDaICwFYEFoCMA2AnOtyByAIiALoC%2BQA; Pin Count: 5

## Sheet motordriver-v5.0_isolation-general.SchDoc
size A4; SheetNumber: 3; SheetTotal: 10
Used 4 times, as channels Isolation 2, Isolation 3, Isolation 4, Isolation. Parts and nets are listed once, with the designators drawn on the sheet.
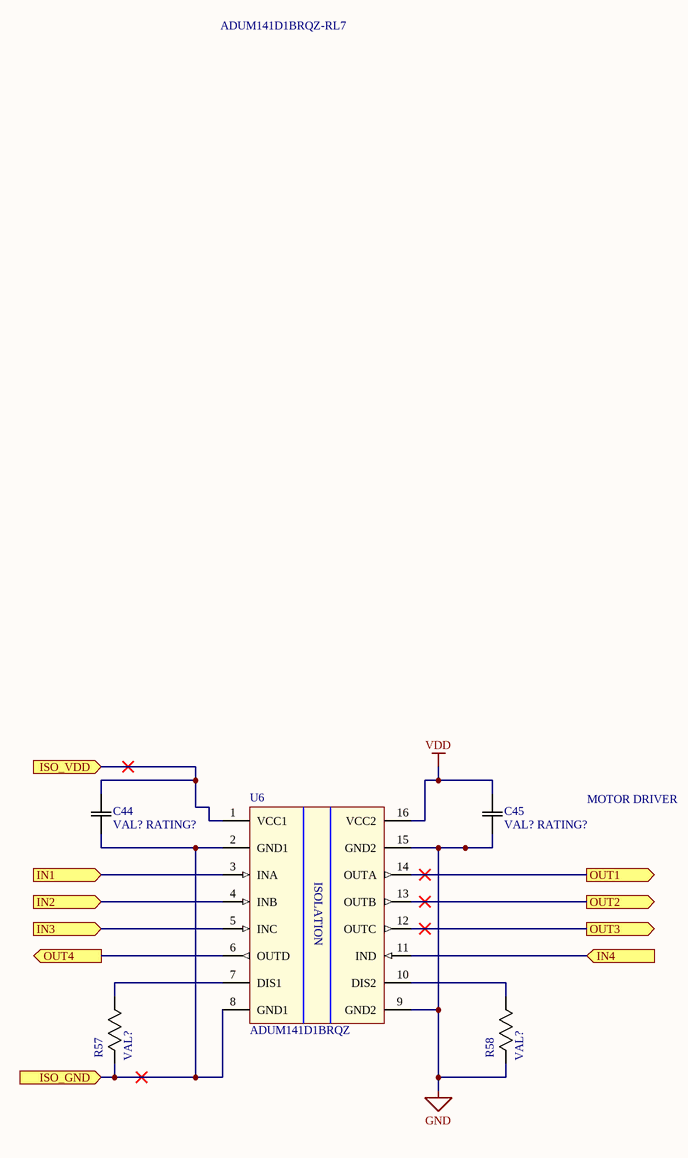
[diagram p9: motordriver-v5.0_isolation-general.SchDoc]

### Parts
C44  VAL? RATING?  [0603]
C45  VAL? RATING?  [0603]
R57  VAL?  [0603]
R58  VAL?  [0603]
U6  ADUM141D1BRQZ  Supplier Part Number 1: ADUM141D1BRQZ-RL7  [SOP64P600X175-16N]

### Ports
IN1 (in), IN2 (in), IN3 (in), IN4 (in), ISO_GND (in), ISO_VDD (in), OUT1 (out), OUT2 (out), OUT3 (out), OUT4 (out)

### Nets
GND: C45.1(C1) R58.2(R2) U6.9(GND2) U6.15(GND2)
VDD: C45.2(C2) U6.16(VCC2)
IN1: U6.3(INA) ; port IN1
IN2: U6.4(INB) ; port IN2
IN3: U6.5(INC) ; port IN3
IN4: U6.11(IND) ; port IN4
ISO_GND: C44.1(C1) R57.2(R2) U6.2(GND1) U6.8(GND1) ; port ISO_GND
ISO_VDD: C44.2(C2) U6.1(VCC1) ; port ISO_VDD
OUT1: U6.14(OUTA) ; port OUT1
OUT2: U6.13(OUTB) ; port OUT2
OUT3: U6.12(OUTC) ; port OUT3
OUT4: U6.6(OUTD) ; port OUT4
NetR57_1: R57.1(R1) U6.7(DIS1)
NetR58_1: R58.1(R1) U6.10(DIS2)

### Channels
Isolation 2: designators end in A; ports IN1=IN1 IN2=ISO_SPI_MOSI0 IN3=ISO_SPI_SCK0 IN4=SPI_MISO0 ISO_GND=JETSON_ISO_GND ISO_VDD=JETSON_ISO_VDD OUT1=BIT_0 OUT2=SPI_MOSI0 OUT3=SPI_SCK0 OUT4=ISO_SPI_MISO0
Isolation 3: designators end in B; ports IN1=IN1 IN2=~{ISO_CS}3 IN3=~{ISO_CS}4 IN4=IN4_Isolation 3 ISO_GND=JETSON_ISO_GND ISO_VDD=JETSON_ISO_VDD OUT1=BIT_1 OUT2=~{CS_DEMUX_3} OUT3=~{CS_DEMUX_4} OUT4=OUT4_Isolation 3
Isolation 4: designators end in C; ports IN1=~{ISO_CS}0 IN2=~{ISO_CS}1 IN3=~{ISO_CS}2 IN4=IN4_Isolation 4 ISO_GND=JETSON_ISO_GND ISO_VDD=JETSON_ISO_VDD OUT1=~{CS_DEMUX_0} OUT2=~{CS_DEMUX_1} OUT3=~{CS_DEMUX_2} OUT4=OUT4_Isolation 4
Isolation: designators end in D; ports IN1=IN1_Isolation IN2=IN2_Isolation IN3=IN3_Isolation IN4=IN4_Isolation ISO_GND=ISO_GND ISO_VDD=ISO_VDD OUT1=OUT1_Isolation OUT2=OUT2_Isolation OUT3=OUT3_Isolation OUT4=OUT4_Isolation

### Notes on the sheet
- MOTOR DRIVER
- (in symbol ISO ADUM141D1BRQZ) ISOLATION

### Library data of the parts
C44 C45 = CAP 100nF 50V: Default Symbol for Capacitors; Manufacturer Part Number 1: CC0603KPX7R9BB104; Value: 100nF; Rating: 50V; Temperature Coefficient: X7R; Tolerance: 10%; Part Number: CAP 100nF 50V; Supplier 1: Digi-Key; Supplier Part Number 1: 311-3567-1-ND; Manufacturer Part Number 2: 0805J0500104KJT; Supplier 2: Digi-Key; Supplier Part Number 2: 1608-1458-1-ND
R57 R58 = RES 4.7k 1/8W - 5%: as R25-R33 on sheet motordriver-v5.0_trinamic-controller; Package: 0805; Part Number: RES 4.7k 1/8W - 5%
U6 = ISO ADUM141D1BRQZ: Digital Isolator CMOS 4-CH 150Mbps 16-Pin QSOP T/R; Manufacturer: Analog Devices; Isolated Power: No; Number of Channels: 4; Channel Type: Unidirectional; Propagation Delay: 13ns; Pulse Width Distortion (PWD): 3ns; Supplier 1: Arrow Electronics; Manufacturer Part Number: ADUM141D1BRQZ-RL7; RoHS: Yes; Category: Interface ICs; Stock 1: 341; Pricing 1: 1=3.87700, 10=3.47000, 25=3.26100, 50=3.22900, 100=2.78500, 250=2.67500 (USD); Mount: Surface Mount; Case/Package: SSOP; Number of Pins: 16; Min Operating Temperature: -40°C; Max Operating Temperature: 125°C; Type: General Purpose; Packaging: Tape and Reel; Data Rate: 150Mbps; RoHS Compliant: Yes; ComponentLink1URL: https://www.analog.com/media/en/technical-documentation/data-sheets/ADuM140D_140E_141D_141E_142D_142E.pdf?src-supplier=Digi-Key; ComponentLink1Description: https://www.analog.com/media/en/technical-documentation/data-sheets/ADuM140D_140E_141D_141E_142D_142E.pdf?src-supplier=Digi-Key

## Sheet motordriver-v5.0_current_amplification.SchDoc
size A4; SheetNumber: 10; SheetTotal: 10
Used 6 times, as channels Current Amplification 0, Current Amplification 1, Current Amplification 2, Current Amplification 3, Current Amplification 4, Current Amplification. Parts and nets are listed once, with the designators drawn on the sheet.
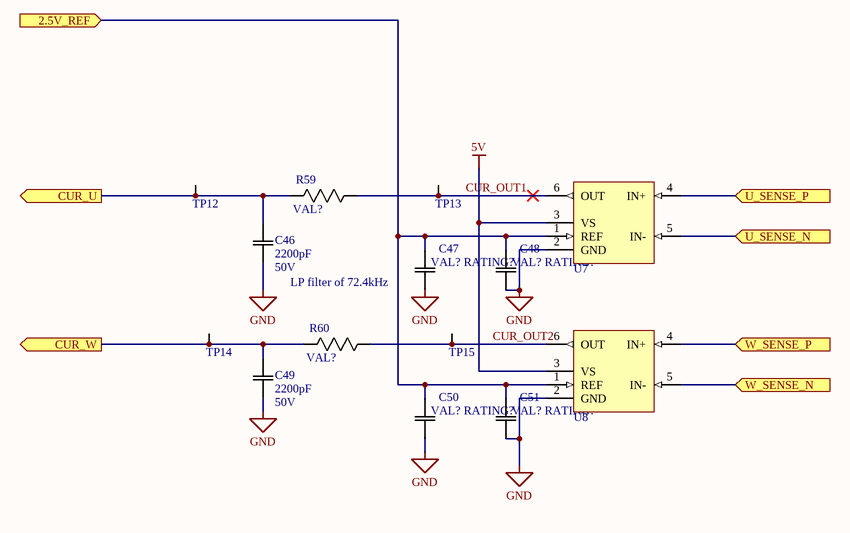
[diagram p10: motordriver-v5.0_current_amplification.SchDoc]

### Parts
C46  value 2200pF  Rating: 50V  [0603]  (hidden comment: VAL? RATING?)
C47  VAL? RATING?  [0603]
C48  VAL? RATING?  [0603]
C49  value 2200pF  Rating: 50V  [0603]  (hidden comment: VAL? RATING?)
C50  VAL? RATING?  [0603]
C51  VAL? RATING?  [0603]
R59  VAL?  [0603]
R60  VAL?  [0603]
TP12  Test Point (Via)  [TP]  (value not drawn)
TP13  Test Point (Via)  [TP]  (value not drawn)
TP14  Test Point (Via)  [TP]  (value not drawn)
TP15  Test Point (Via)  [TP]  (value not drawn)
U7  OP AMP CURR SENSE BI TSC  [SC70-6]  (value not drawn)
U8  OP AMP CURR SENSE BI TSC  [SC70-6]  (value not drawn)

### Ports
2.5V_REF (in), CUR_U (out), CUR_W (out), U_SENSE_N (in), U_SENSE_P (in), W_SENSE_N (in), W_SENSE_P (in)

### Nets
5V: U7.3(VS) U8.3(VS)
GND: C46.1(C1) C47.1(C1) C48.1(C1) C49.1(C1) C50.1(C1) C51.1(C1) U7.2(GND) U8.2(GND)
2.5V_REF: C47.2(C2) C48.2(C2) C50.2(C2) C51.2(C2) U7.1(REF) U8.1(REF) ; port 2.5V_REF
CUR_OUT1: R59.1(R1) TP13.1 U7.6(OUT)
CUR_OUT2: R60.1(R1) TP15.1 U8.6(OUT)
CUR_U: C46.2(C2) R59.2(R2) TP12.1 ; port CUR_U
CUR_W: C49.2(C2) R60.2(R2) TP14.1 ; port CUR_W
U_SENSE_N: U7.5(IN-) ; port U_SENSE_N
U_SENSE_P: U7.4(IN+) ; port U_SENSE_P
W_SENSE_N: U8.5(IN-) ; port W_SENSE_N
W_SENSE_P: U8.4(IN+) ; port W_SENSE_P

### Channels
Current Amplification 0: designators end in A; ports 2.5V_REF=2.5V_REF CUR_U=CUR_U0 CUR_W=CUR_W0 U_SENSE_N=U0 U_SENSE_P=U W_SENSE_N=W0 W_SENSE_P=W
Current Amplification 1: designators end in B; ports 2.5V_REF=2.5V_REF CUR_U=CUR_U1 CUR_W=CUR_W1 U_SENSE_N=U1 U_SENSE_P=U W_SENSE_N=W1 W_SENSE_P=W
Current Amplification 2: designators end in C; ports 2.5V_REF=2.5V_REF CUR_U=CUR_U2 CUR_W=CUR_W2 U_SENSE_N=U2 U_SENSE_P=U W_SENSE_N=W2 W_SENSE_P=W
Current Amplification 3: designators end in D; ports 2.5V_REF=2.5V_REF CUR_U=CUR_U3 CUR_W=CUR_W3 U_SENSE_N=U3 U_SENSE_P=U W_SENSE_N=W3 W_SENSE_P=W
Current Amplification 4: designators end in E; ports 2.5V_REF=2.5V_REF CUR_U=CUR_U4 CUR_W=CUR_W4 U_SENSE_N=U4_IN U_SENSE_P=U W_SENSE_N=W4_IN W_SENSE_P=W
Current Amplification: designators end in F; ports 2.5V_REF=2.5V_REF_Current Amplification CUR_U=CUR_U_Current Amplification CUR_W=CUR_W_Current Amplification U_SENSE_N=U_SENSE_N_Current Amplification U_SENSE_P=U_SENSE_P_Current Amplification W_SENSE_N=W_SENSE_N_Current Amplification W_SENSE_P=W_SENSE_P_Current Amplification

### Notes on the sheet
- (near C47) LP filter of 72.4kHz

### Library data of the parts
C46 C49 = CAP 2200pF 50V: Default Symbol for Capacitors; Manufacturer Part Number 1: 06035C222KAT2A; Tolerance: 10%; Temperature Coefficient: X7R; Part Number: CAP 2200pF 50V; Supplier 1: Digi-Key; Supplier Part Number 1: 478-1219-1-ND; Manufacturer Part Number 2: CL21B222KBANNNC; Supplier 2: Digi-Key; Supplier Part Number 2: 1276-1171-1-ND
C47 C48 C50 C51 = CAP 100nF 50V: as C6 on sheet motordriver-v5.0_trinamic-controller; Part Number: CAP 100nF 50V; Supplier 1: Digi-Key; Supplier Part Number 1: 311-3567-1-ND; Manufacturer Part Number 2: 0805J0500104KJT; Supplier 2: Digi-Key; Supplier Part Number 2: 1608-1458-1-ND
R59 R60 = RES 1k 1/8W - 1%: as R34-R36 on sheet motordriver-v5.0_trinamic-controller; Package: 0805; Part Number: RES 1k 1/8W - 1%; Supplier 1: Digi-Key; Supplier Part Number 1: MCT0603-1.00K-CFCT-ND; Manufacturer Part Number 2: RMCF0805FT1K00; Supplier 2: Digi-Key; Supplier Part Number 2: RMCF0805FT1K00CT-ND; Tolerance 2: 1%
U7 U8 = OP AMP CURR SENSE BI TSC: SP Amp Current Sense Amp Single R-R O/P 5.5V Automotive 6-Pin SC-70 T/R; Manufacturer Part Number: TSC214ICT; Supplier 1: Digi-Key; Supplier Part Number 1: 497-TSC214ICT-ND; Part Number: OP AMP CURR SENSE BI TSC; Suppler URL 1: https://www.digikey.ca/en/products/detail/stmicroelectronics/TSC214ICT/14291430?s=N4IgTCBcDaICwE4DsBaAKgZQMJgIxwEks0UA5AERAF0BfIA
TP12-TP15 = Test Point (Via): Part Number: Test Point (Via)

## Sheet motordriver-v5.1_demux_dribbler.SchDoc
size A4; SheetNumber: 12; SheetTotal: 12
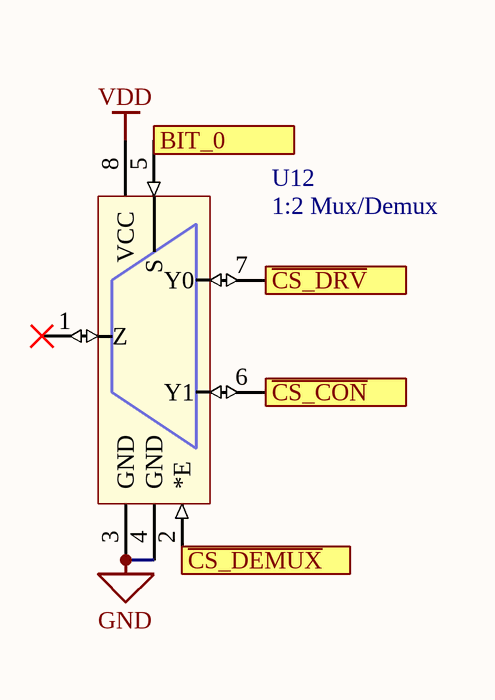
[diagram p11: motordriver-v5.1_demux_dribbler.SchDoc]

### Parts
U12  1:2 Mux/Demux  [TSOP65P400X110-8N]

### Ports
BIT_0 (in), ~{CS_CON} (out), ~{CS_DEMUX} (in), ~{CS_DRV} (out)

### Nets
GND: U12.3(GND) U12.4(GND)
VDD: U12.8(VCC)
BIT_0: U12.5(S) ; port BIT_0
~{CS}4: U12.6(Y1) ; port ~{CS_CON}
~{CS_DEMUX_4}: U12.2(*E) ; port ~{CS_DEMUX}
~{CS_DRV}4: U12.7(Y0) ; port ~{CS_DRV}

Not connected (* = marked no-connect by the designer): U12 1(Z)*

### Library data of the parts
U12 = 74LVC1G53DP,125: 74LVC Series 5.5 V SMT 2-Channel Analog Multiplexer/Demultiplexer - TSSOP-8; Part Number: 74LVC1G53DP,125; Manufacturer Part Number: 74LVC1G53DP,125; Supplier 1: Digi-Key; Supplier Part Number 1: 1727-6078-1-ND; Suppler URL 1: https://www.digikey.ca/en/products/detail/nexperia-usa-inc/74LVC1G53DP-125/1300844

## Sheet motordriver-v5.1_demux.SchDoc
size A4; SheetNumber: 11; SheetTotal: 12
Used 2 times, as channels U_motordriver-v5.1_demux, U_motordriver-v5.1_demux. Parts and nets are listed once, with the designators drawn on the sheet.
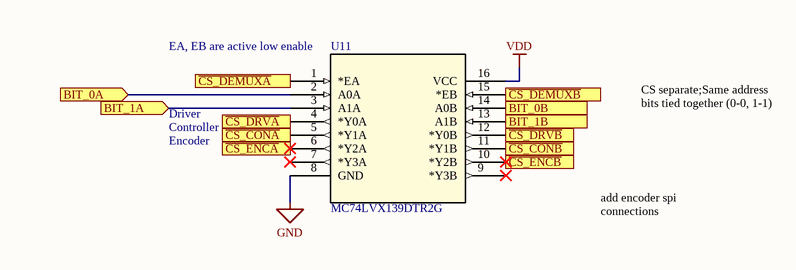
[diagram p12: motordriver-v5.1_demux.SchDoc]

### Parts
U11  MC74LVX139DTR2G  [TSSOP-16_ONS]

### Ports
BIT_0A (in), BIT_0B (in), BIT_1A (in), BIT_1B (in), ~{CS_CONA} (out), ~{CS_CONB} (out), ~{CS_DEMUXA} (in), ~{CS_DEMUXB} (in), ~{CS_DRVA} (out), ~{CS_DRVB} (out), ~{CS_ENCA} (out), ~{CS_ENCB} (out)

### Nets
GND: U11.8(GND)
VDD: U11.16(VCC)
BIT_0A: U11.2(A0A) ; port BIT_0A
BIT_0B: U11.14(A0B) ; port BIT_0B
BIT_1A: U11.3(A1A) ; port BIT_1A
BIT_1B: U11.13(A1B) ; port BIT_1B
~{CS_CONA}: U11.5(*Y1A) ; port ~{CS_CONA}
~{CS_CONB}: U11.11(*Y1B) ; port ~{CS_CONB}
~{CS_DEMUXA}: U11.1(*EA) ; port ~{CS_DEMUXA}
~{CS_DEMUXB}: U11.15(*EB) ; port ~{CS_DEMUXB}
~{CS_DRVA}: U11.4(*Y0A) ; port ~{CS_DRVA}
~{CS_DRVB}: U11.12(*Y0B) ; port ~{CS_DRVB}
~{CS_ENCA}: U11.6(*Y2A) ; port ~{CS_ENCA}
~{CS_ENCB}: U11.10(*Y2B) ; port ~{CS_ENCB}

Not connected (* = marked no-connect by the designer): U11 7(*Y3A)* 9(*Y3B)*

### Channels
U_motordriver-v5.1_demux: designators end in A; ports BIT_0A=BIT_0 BIT_0B=BIT_0 BIT_1A=BIT_1 BIT_1B=BIT_1 ~{CS_CONA}=~{CS}0 ~{CS_CONB}=~{CS}1 ~{CS_DEMUXA}=~{CS_DEMUX_0} ~{CS_DEMUXB}=~{CS_DEMUX_1} ~{CS_DRVA}=~{CS_DRV}0 ~{CS_DRVB}=~{CS_DRV}1 ~{CS_ENCA}=~{CS_ENC0} ~{CS_ENCB}=~{CS_ENC1}
U_motordriver-v5.1_demux: designators end in B; ports BIT_0A=BIT_0 BIT_0B=BIT_0 BIT_1A=BIT_1 BIT_1B=BIT_1 ~{CS_CONA}=~{CS}2 ~{CS_CONB}=~{CS}3 ~{CS_DEMUXA}=~{CS_DEMUX_2} ~{CS_DEMUXB}=~{CS_DEMUX_3} ~{CS_DRVA}=~{CS_DRV}2 ~{CS_DRVB}=~{CS_DRV}3 ~{CS_ENCA}=~{CS_ENC2} ~{CS_ENCB}=~{CS_ENC3}

### Notes on the sheet
- (near U11) EA, EB are active low enable
- Controller
- Driver
- Encoder
- CS separate;Same address bits tied together (0-0, 1-1)
- add encoder spi connections

### Library data of the parts
U11 = MC74LVX139DTR2G: 2-3.6V Dual 2-to-8 Decoder; Mfr_Name: onsemi; Manufacturer Part Number: MC74LVX139DTR2G / MC74LVX139DTR2GMC74LVX139DTR2G / MC74LVX139DTR2GMC74LVX139DTR2G / MC74LVX139DTR2G; Manufacturer_Part_Number: MC74LVX139DTR2G; Digi-Key_Part_Number_1: MC74LVX139DTR2G-ND; Digi-Key_Part_Number_2: 2156-MC74LVX139DTR2G-OS-ND; Type: DEV; Supplier: Mouser; Link: https://www.mouser.ca/ProductDetail/onsemi/MC74LVX139DTR2G?qs=YOLdObVcOZlxCYeV3EwYHQ%3D%3D*; Part Number: MC74LVX139DTR2G; Supplier 1: Mouser; Supplier Part Number 1: 863-MC74LVX139DTR2G; Suppler URL 1: https://www.mouser.ca/ProductDetail/onsemi/MC74LVX139DTR2G?qs=YOLdObVcOZlxCYeV3EwYHQ%3D%3D

## Sheet top-level-simplified.SchDoc
size A4; SheetNumber: 11; SheetTotal: 12
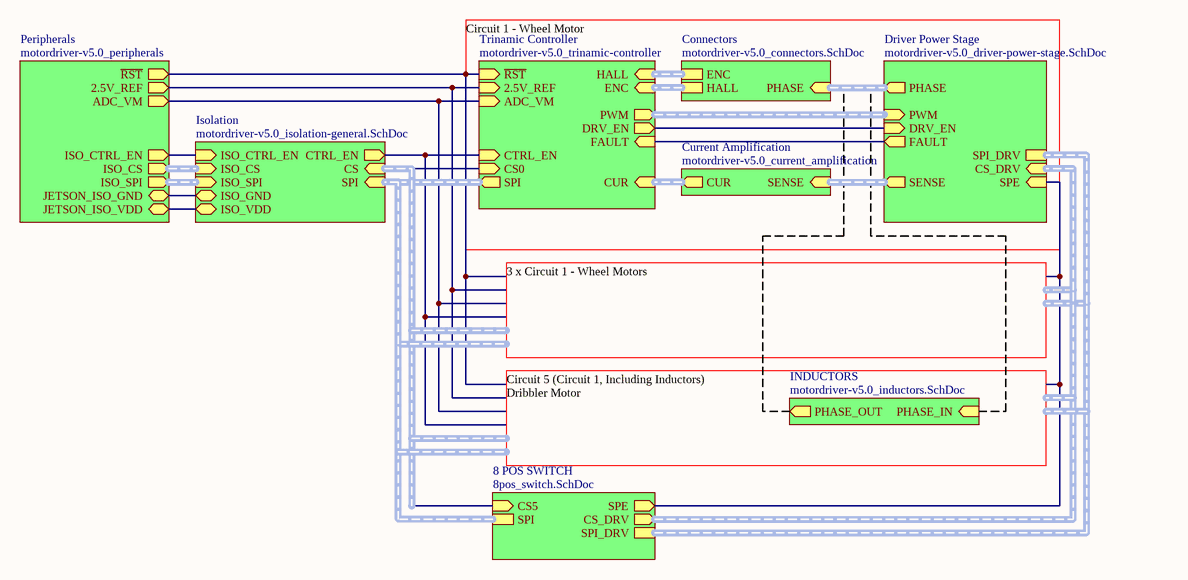
[diagram p13: top-level-simplified.SchDoc]

### Sub-sheets
8 POS SWITCH = 8pos_switch.SchDoc (file not in this document): CS5 (in), SPI, CS_DRV (out), SPI_DRV, SPE (out)
Connectors = motordriver-v5.0_connectors.SchDoc: PHASE (in), ENC, HALL
Current Amplification = motordriver-v5.0_current_amplification: SENSE (in), CUR (out)
Driver Power Stage = motordriver-v5.0_driver-power-stage.SchDoc: DRV_EN (in), PWM (in), FAULT (out), SENSE (out), PHASE (out), SPE (in), CS_DRV (in), SPI_DRV
INDUCTORS = motordriver-v5.0_inductors.SchDoc: PHASE_IN (in), PHASE_OUT (out)
Isolation = motordriver-v5.0_isolation-general.SchDoc: ISO_SPI (in), ISO_CS (in), ISO_GND (bidir), ISO_VDD (bidir), SPI (in), CS (in), ISO_CTRL_EN (in), CTRL_EN (out)
Peripherals = motordriver-v5.0_peripherals: ~{RST} (out), ADC_VM (out), ISO_CTRL_EN (out), JETSON_ISO_VDD (bidir), JETSON_ISO_GND (bidir), ISO_CS (out), 2.5V_REF (out), ISO_SPI (out)
Trinamic Controller = motordriver-v5.0_trinamic-controller: ~{RST} (in), CUR (in), DRV_EN (out), ADC_VM (in), CTRL_EN (in), PWM (out), HALL (in), ENC (in), 2.5V_REF (in), FAULT (in), SPI (out), CS0 (in)

### Nets
2.5V_REF: sheet Peripherals/2.5V_REF, sheet Trinamic Controller/2.5V_REF
ADC_VM: sheet Peripherals/ADC_VM, sheet Trinamic Controller/ADC_VM
CTRL_EN_Trinamic Controller: sheet Trinamic Controller/CTRL_EN, sheet Isolation/CTRL_EN
DRV_EN: sheet Driver Power Stage/DRV_EN, sheet Trinamic Controller/DRV_EN
FAULT: sheet Driver Power Stage/FAULT, sheet Trinamic Controller/FAULT
ISO_CTRL_EN_Peripherals: sheet Peripherals/ISO_CTRL_EN, sheet Isolation/ISO_CTRL_EN
ISO_GND: sheet Peripherals/JETSON_ISO_GND, sheet Isolation/ISO_GND
ISO_VDD: sheet Peripherals/JETSON_ISO_VDD, sheet Isolation/ISO_VDD
~{RST}: sheet Peripherals/~{RST}, sheet Trinamic Controller/~{RST}
(unnamed): sheet Driver Power Stage/SPE, sheet 8 POS SWITCH/SPE

### Buses and harness runs
harness sheet 8 POS SWITCH/CS_DRV = sheet Driver Power Stage/CS_DRV
harness sheet 8 POS SWITCH/SPI = sheet Isolation/SPI = sheet Trinamic Controller/SPI
harness sheet 8 POS SWITCH/SPI_DRV = sheet Driver Power Stage/SPI_DRV
harness sheet Connectors/ENC = sheet Trinamic Controller/HALL
harness sheet Connectors/HALL = sheet Trinamic Controller/ENC
harness sheet Connectors/PHASE = sheet Driver Power Stage/PHASE
harness sheet Current Amplification/CUR = sheet Trinamic Controller/CUR
harness sheet Current Amplification/SENSE = sheet Driver Power Stage/SENSE
harness sheet Driver Power Stage/PWM = sheet Trinamic Controller/PWM
harness sheet Isolation/ISO_CS = sheet Peripherals/ISO_CS
harness sheet Isolation/ISO_SPI = sheet Peripherals/ISO_SPI

### Notes on the sheet
- Circuit 1 - Wheel Motor
- 3 x Circuit 1 - Wheel Motors
- Circuit 5 (Circuit 1, Including Inductors)
  Dribbler Motor